# Altium schematic sheet I2C_MUX.SchDoc
size A; SheetNumber: 4; SheetTotal: 6
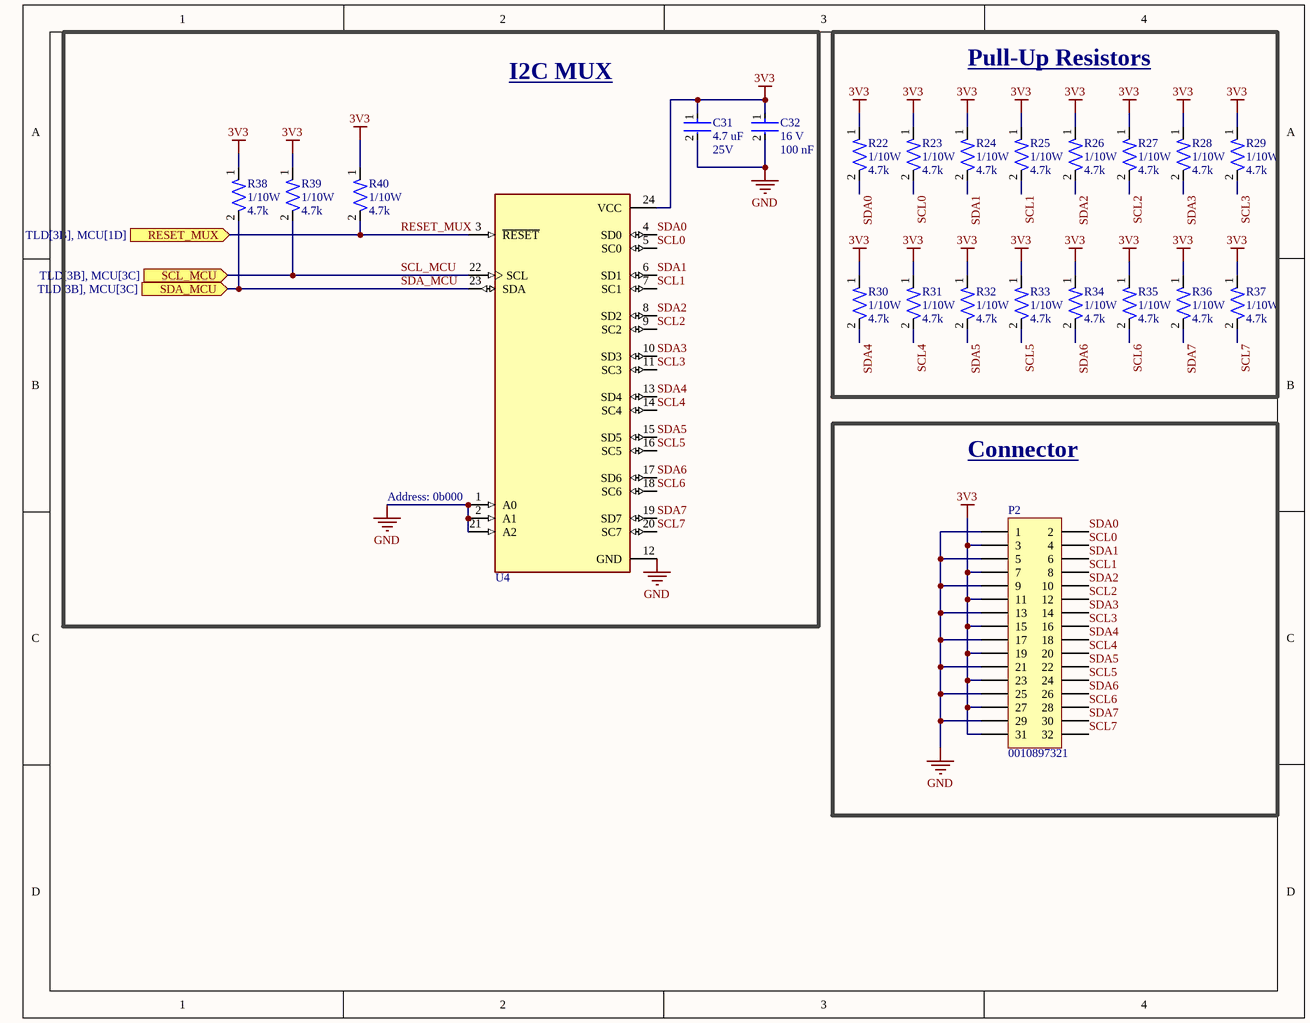
[diagram p0: I2C_MUX.SchDoc]

## Parts
C31  Capacitance: 4.7 uF  Voltage: 25V  [CAP-0603]  (hidden comment: CC0603KRX5R8BB475)
C32  Voltage Rating: 16 V  Capacitance: 100 nF  [CAP-0402]  (hidden comment: CC0402KRX7R7BB104)
P2  0010897321  [HDR2X16]
R22  Power: 1/10W  Resistance: 4.7k  [RES-0603]  (hidden comment: RC0603FR-074K7L)
R23  Power: 1/10W  Resistance: 4.7k  [RES-0603]  (hidden comment: RC0603FR-074K7L)
R24  Power: 1/10W  Resistance: 4.7k  [RES-0603]  (hidden comment: RC0603FR-074K7L)
R25  Power: 1/10W  Resistance: 4.7k  [RES-0603]  (hidden comment: RC0603FR-074K7L)
R26  Power: 1/10W  Resistance: 4.7k  [RES-0603]  (hidden comment: RC0603FR-074K7L)
R27  Power: 1/10W  Resistance: 4.7k  [RES-0603]  (hidden comment: RC0603FR-074K7L)
R28  Power: 1/10W  Resistance: 4.7k  [RES-0603]  (hidden comment: RC0603FR-074K7L)
R29  Power: 1/10W  Resistance: 4.7k  [RES-0603]  (hidden comment: RC0603FR-074K7L)
R30  Power: 1/10W  Resistance: 4.7k  [RES-0603]  (hidden comment: RC0603FR-074K7L)
R31  Power: 1/10W  Resistance: 4.7k  [RES-0603]  (hidden comment: RC0603FR-074K7L)
R32  Power: 1/10W  Resistance: 4.7k  [RES-0603]  (hidden comment: RC0603FR-074K7L)
R33  Power: 1/10W  Resistance: 4.7k  [RES-0603]  (hidden comment: RC0603FR-074K7L)
R34  Power: 1/10W  Resistance: 4.7k  [RES-0603]  (hidden comment: RC0603FR-074K7L)
R35  Power: 1/10W  Resistance: 4.7k  [RES-0603]  (hidden comment: RC0603FR-074K7L)
R36  Power: 1/10W  Resistance: 4.7k  [RES-0603]  (hidden comment: RC0603FR-074K7L)
R37  Power: 1/10W  Resistance: 4.7k  [RES-0603]  (hidden comment: RC0603FR-074K7L)
R38  Power: 1/10W  Resistance: 4.7k  [RES-0603]  (hidden comment: RC0603FR-074K7L)
R39  Power: 1/10W  Resistance: 4.7k  [RES-0603]  (hidden comment: RC0603FR-074K7L)
R40  Power: 1/10W  Resistance: 4.7k  [RES-0603]  (hidden comment: RC0603FR-074K7L)
U4  TCA9548APWR  [SOP65P640X120-24N]  (value not drawn)

## Blocks framed on the sheet
I2C MUX: C31 C32 R38-R40 U4
Pull-Up Resistors: R22-R37
Connector: P2

## Ports
RESET_MUX (in, see TLD[3B], MCU[1D]), SCL_MCU (in, see TLD[3B], MCU[3C]), SDA_MCU (in, see TLD[3B], MCU[3C])

## Nets
3V3: C31.1 C32.1 P2.3 P2.7 P2.11 P2.15 P2.19 P2.23 P2.27 P2.31 R22.1 R23.1 R24.1 R25.1 R26.1 R27.1 R28.1 R29.1 R30.1 R31.1 R32.1 R33.1 R34.1 R35.1 R36.1 R37.1 R38.1 R39.1 R40.1 U4.24(VCC)
GND: C31.2 C32.2 P2.1 P2.5 P2.9 P2.13 P2.17 P2.21 P2.25 P2.29 U4.1(A0) U4.2(A1) U4.12(GND) U4.21(A2)
RESET_MUX: R40.2 U4.3(~{RESET}) ; port RESET_MUX
SCL0: P2.4 R23.2 U4.5(SC0)
SCL1: P2.8 R25.2 U4.7(SC1)
SCL2: P2.12 R27.2 U4.9(SC2)
SCL3: P2.16 R29.2 U4.11(SC3)
SCL4: P2.20 R31.2 U4.14(SC4)
SCL5: P2.24 R33.2 U4.16(SC5)
SCL6: P2.28 R35.2 U4.18(SC6)
SCL7: P2.32 R37.2 U4.20(SC7)
SCL_MCU: R39.2 U4.22(SCL) ; port SCL_MCU
SDA0: P2.2 R22.2 U4.4(SD0)
SDA1: P2.6 R24.2 U4.6(SD1)
SDA2: P2.10 R26.2 U4.8(SD2)
SDA3: P2.14 R28.2 U4.10(SD3)
SDA4: P2.18 R30.2 U4.13(SD4)
SDA5: P2.22 R32.2 U4.15(SD5)
SDA6: P2.26 R34.2 U4.17(SD6)
SDA7: P2.30 R36.2 U4.19(SD7)
SDA_MCU: R38.2 U4.23(SDA) ; port SDA_MCU

## Notes on the sheet
- (near U4) Address: 0b000

## Library data of the parts
C31 = CAP-4.7U-0001: CAP CER 4.7UF 25V X5R 0603; Device Class: Ceramic; Size: 0603
C32 = CAP-0.1U-0001: CAP CER 0.1UF 16V X7R 0402; ComponentLink2Description: Datasheet; ComponentLink2URL: https://www.yageo.com/upload/media/product/productsearch/datasheet/mlcc/UPY-GPHC_X7R_6.3V-to-250V_24.pdf; Device Class: Ceramic; Size: 0402
P2 = Header 16X2: Header, 16-Pin, Dual row; LatestRevisionDate: 17-Jul-2002; LatestRevisionNote: Re-released for DXP Platform.; Publisher: Altium Limited
R22-R40 = RES-4.7k-0001: RES 4.7K OHM 1% 1/10W 0603; Tolerance: 1%; Size: 0603; ComponentLink1Description: Datasheet; ComponentLink1URL: https://www.yageo.com/upload/media/product/products/datasheet/rchip/PYu-RC_Group_51_RoHS_L_12.pdf
U4 = IC-MUX-0002: 8-channel 1.65- to 5.5-V I2C/SMBus switch with reset & voltage translation; MF: Texas Instruments; SnapEDA_Link: https://www.snapeda.com/parts/TCA9548APWR/Texas+Instruments/view-part/?ref=snap; Package: TSSOP-24 Texas Instruments; Value: *; MP: TCA9548APWR; Check_prices: https://www.snapeda.com/parts/TCA9548APWR/Texas+Instruments/view-part/?ref=eda; ComponentLink1Description: Datasheet; ComponentLink1URL: https://www.ti.com/general/docs/suppproductinfo.tsp?distId=10&gotoUrl=https%3A%2F%2Fwww.ti.com%2Flit%2Fgpn%2Ftca9548a